# EAGLE design untitled (EAGLE 9.0.0)
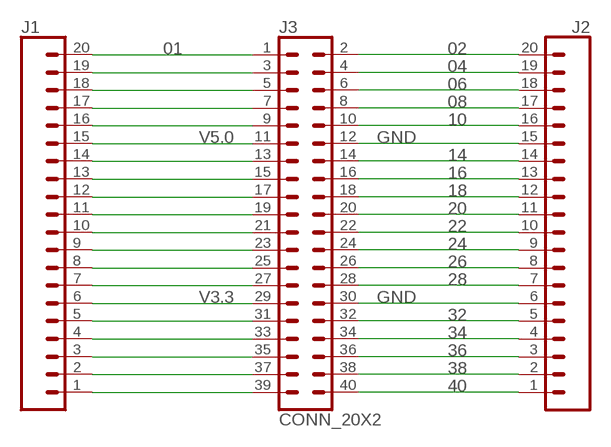
[diagram p0: schematic, sheet 1]

## Parts
J1  CONN_20  [1X20]
J2  CONN_20  [1X20]
J3  CONN_20X2  [2X20]

## Nets
01: J1.20 J3.1
02: J2.20 J3.2
04: J2.19 J3.4
5: J1.18 J3.5
06: J2.18 J3.6
08: J2.17 J3.8
10: J2.16 J3.10
14: J2.14 J3.14
15: J1.13 J3.15
16: J2.13 J3.16
18: J2.12 J3.18
20: J2.11 J3.20
22: J2.10 J3.22
24: J2.9 J3.24
25: J1.8 J3.25
26: J2.8 J3.26
28: J2.7 J3.28
32: J2.5 J3.32
34: J2.4 J3.34
35: J1.3 J3.35
36: J2.3 J3.36
38: J2.2 J3.38
39: J1.1 J3.39
40: J2.1 J3.40
GND: J2.6 J2.15 J3.12 J3.30
N$1: J1.19 J3.3
N$22: J1.2 J3.37
N$24: J1.4 J3.33
N$25: J1.5 J3.31
N$27: J1.7 J3.27
N$29: J1.9 J3.23
N$30: J1.10 J3.21
N$31: J1.11 J3.19
N$32: J1.12 J3.17
N$34: J1.14 J3.13
N$36: J1.16 J3.9
N$37: J1.17 J3.7
V3.3: J1.6 J3.29
V5.0: J1.15 J3.11

## Library data of the parts
J1 J2 = SparkFun-Connectors:CONN_20: Multi connection point. Often used as Generic Header-pin footprint for 0.1 inch spaced/style header connections On any of the 0.1 inch spaced packages, you can populate with these: Break Away Headers - Straight <https://www.sparkfun.com/products/116> (PRT-00116) Break Away Male Headers - Right Angle <https://www.sparkfun.com/products/553> (PRT-00553) Female Headers <https://www.sparkfun.com/products/115> (PRT-00115) Break Away Headers - Machine Pin <https://www.sparkfun.com/products/117> (PRT-00117) Break Away Female Headers - Swiss Machine Pin <https://www.sparkfun.com/products/743> (PRT-00743) For SCREWTERMINALS and SPRING TERMINALS visit here: Screw Terimnals on SparkFun.com <https://www.sparkfun.com/search/results?term=Screw+Terminals> (5mm/3.5mm/2.54mm spacing) This device is also useful as a general connection point to wire up your design to another part of your project. Our various solder wires solder well into these plated through hole pads. Hook-Up Wire - Assortment (Stranded, 22 AWG) <https://www.sparkfun.com/products/11375> (PRT-11375) Hook-Up Wire - Assortment (Solid Core, 22 AWG) <https://www.sparkfun.com/products/11367> (PRT-11367) View the entire wire category on our website here <https://www.sparkfun.com/categories/141> Special notes: Molex polarized connector foot print use with SKU : PRT-08231 with associated crimp pins and housings. 1MM SMD Version SKU: PRT-10208 NOTES ON THE VARIANTS LOCK and LOCK_LONGPADS... This footprint was designed to help hold the alignment of a through-hole component (i.e. 6-pin header) while soldering it into place. You may notice that each hole has been shifted either up or down by 0.005 of an inch from it's more standard position (which is a perfectly straight line). This slight alteration caused the pins (the squares in the middle) to touch the edges of the holes. Because they are alternating, it causes a "brace" to hold the component in place. 0.005 has proven to be the perfect amount of "off-center" position when using our standard breakaway headers. Although looks a little odd when you look at the bare footprint, once you have a header in there, the alteration is very hard to notice. Also,if you push a header all the way into place, it is covered up entirely on the bottom side. Note about LOCK SPECIAL package: This is just like the LOCK variant in that the holes are staggared by 5 mil, but except for the last two holes. They are not altered from the "standard" footprint layout. This is used for a special purpose on the layout of our Graphic LCD Backpack. Make sure you want to use this device before selecting it for you project!
J3 = SparkFun-Connectors:CONN_20X2: Multi connection point. Often used as Generic Header-pin footprint for 0.1 inch spaced/style header connections On any of the 0.1 inch spaced packages, you can populate with these: Break Away Headers - Straight <https://www.sparkfun.com/products/116> (PRT-00116) Break Away Male Headers - Right Angle <https://www.sparkfun.com/products/553> (PRT-00553) Female Headers <https://www.sparkfun.com/products/115> (PRT-00115) Break Away Headers - Machine Pin <https://www.sparkfun.com/products/117> (PRT-00117) Break Away Female Headers - Swiss Machine Pin <https://www.sparkfun.com/products/743> (PRT-00743)

## Board
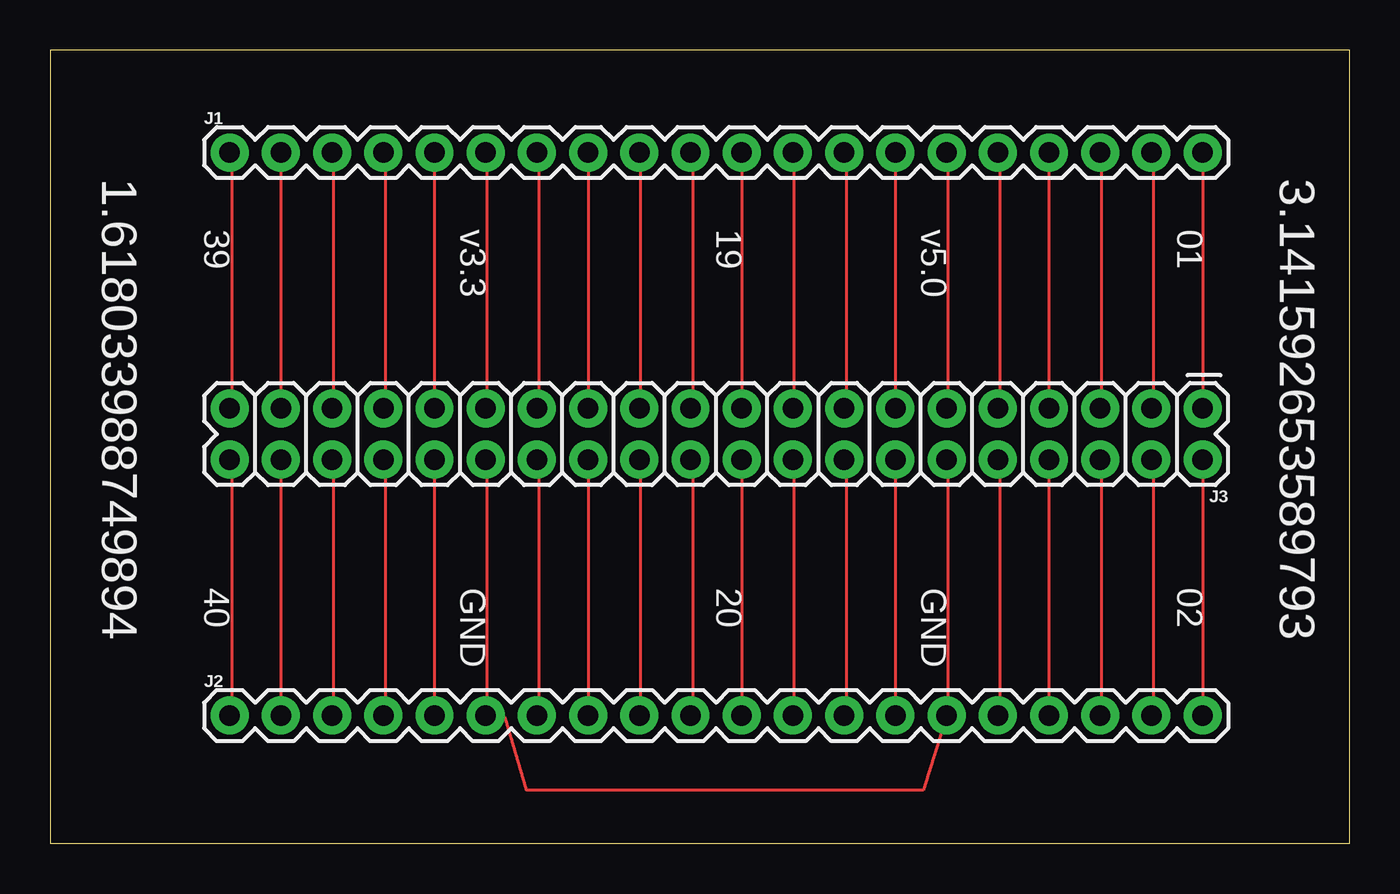
[diagram p1: board, top side]
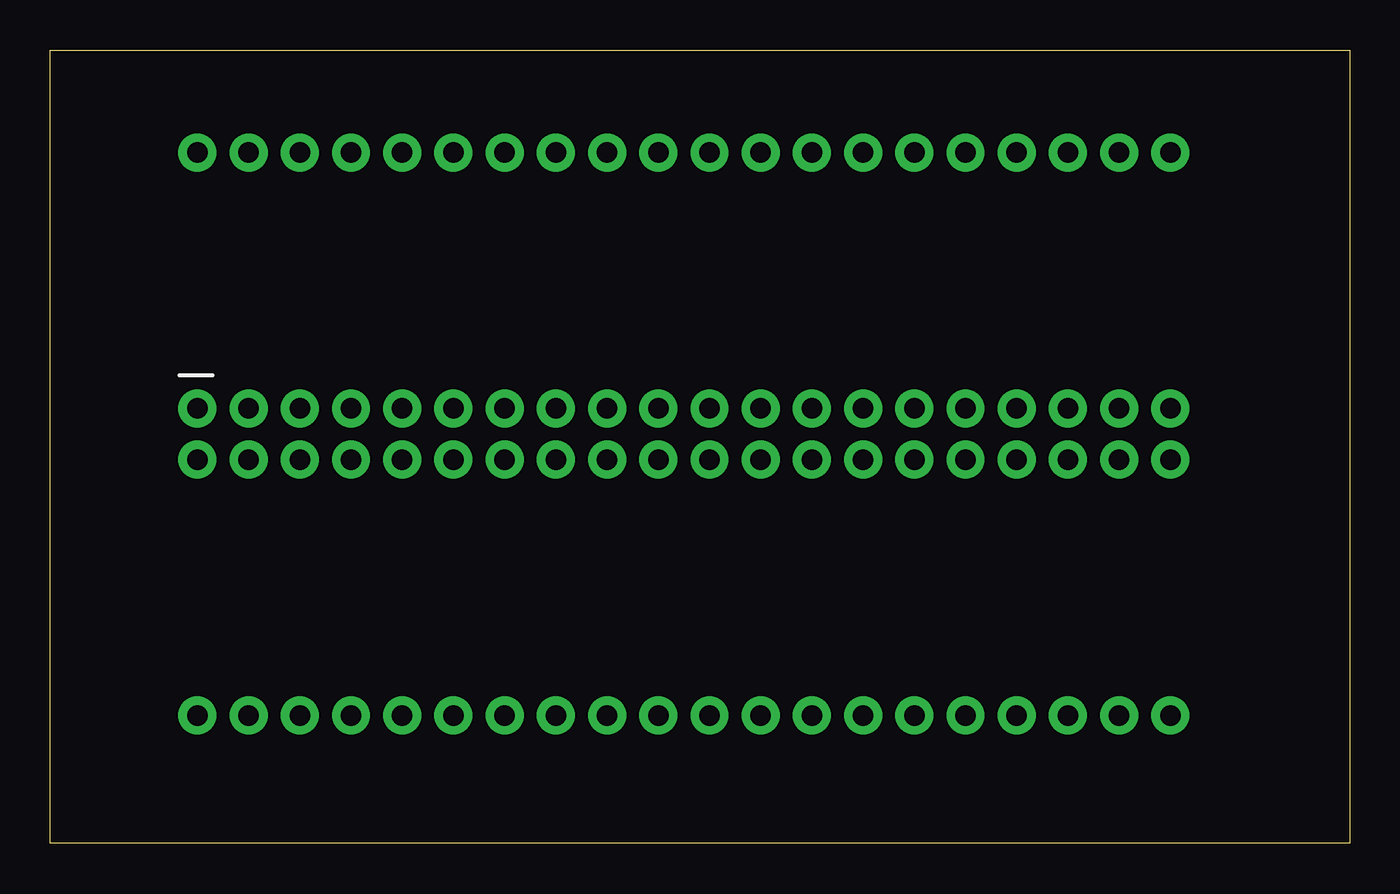
[diagram p2: board, bottom side, seen from below]

Size 64.44 x 39.36 mm. Coordinates in mm from the lower left corner, seen from the top.
Outline: 0,0 64.44,0 64.44,39.36 0,39.36 0,0
Copper layers (1*16): Top 0.035559375mm / dielectric 1.6mm / Bottom 0.035559375mm
Design rules "oshpark-2layer": minimum track width 6mil, minimum drill 10mil, track to track 6mil, track to pad 6mil, pad to pad 6mil, via to via 6mil, smd to smd 6mil, copper to edge 15mil, drill to drill 6mil, minimum pad ring 5mil, minimum via ring 5mil, stop-mask expansion 2.5mil, vias tented up to drill 0mil, thermal gap 10mil

### Footprints (pad centres in the part's own frame; a part is rotated, then mirrored left to right if it is on the bottom)
1X20 = drill 1.016 pad 1.88: 1 0,0; 2 2.54,0; 3 5.08,0; 4 7.62,0; 5 10.16,0; 6 12.7,0; 7 15.24,0; 8 17.78,0; 9 20.32,0; 10 22.86,0; 11 25.4,0; 12 27.94,0; 13 30.48,0; 14 33.02,0; 15 35.56,0; 16 38.1,0; 17 40.64,0; 18 43.18,0; 19 45.72,0; 20 48.26,0
2X20 = drill 1.016 pad 1.88: 1 0,0; 2 0,2.54; 3 2.54,0; 4 2.54,2.54; 5 5.08,0; 6 5.08,2.54; 7 7.62,0; 8 7.62,2.54; 9 10.16,0; 10 10.16,2.54; 11 12.7,0; 12 12.7,2.54; 13 15.24,0; 14 15.24,2.54; 15 17.78,0; 16 17.78,2.54; 17 20.32,0; 18 20.32,2.54; 19 22.86,0; 20 22.86,2.54; 21 25.4,0; 22 25.4,2.54; 23 27.94,0; 24 27.94,2.54; 25 30.48,0; 26 30.48,2.54; 27 33.02,0; 28 33.02,2.54; 29 35.56,0; 30 35.56,2.54; 31 38.1,0; 32 38.1,2.54; 33 40.64,0; 34 40.64,2.54; 35 43.18,0; 36 43.18,2.54; 37 45.72,0; 38 45.72,2.54; 39 48.26,0; 40 48.26,2.54

### Placement (x,y rotation side)
J1  8.89,34.29 0 top
J2  8.89,6.35 0 top
J3  57.15,21.59 180 top

### Tracks (layer width: path | path; a pad name or v marks a point on that pad's centre or on a via)
01
  Top 0.152: J1.20 J3.1
02
  Top 0.152: J3.2 J2.20
04
  Top 0.152: J2.19 54.71,6.4 54.71,19.05 J3.4
5
  Top 0.152: J3.5 52.12,21.64 52.12,34.29 J1.18
06
  Top 0.152: J2.18 52.12,6.4 52.12,19.05 J3.6
08
  Top 0.152: J3.8 J2.17
10
  Top 0.152: J2.16 47.09,6.4 47.09,19.05 J3.10
14
  Top 0.152: J3.14 J2.14
15
  Top 0.152: J3.15 39.47,21.64 39.47,34.29 J1.13
16
  Top 0.152: J2.13 39.47,6.4 39.47,19.05 J3.16
18
  Top 0.152: J2.12 36.88,6.4 36.88,19.05 J3.18
20
  Top 0.152: J3.20 J2.11
22
  Top 0.152: J2.10 31.85,6.4 31.85,19.05 J3.22
24
  Top 0.152: J2.9 29.26,6.4 29.26,19.05 J3.24
25
  Top 0.152: J1.8 J3.25
26
  Top 0.152: J3.26 J2.8
28
  Top 0.152: J2.7 24.23,6.4 24.23,19.05 J3.28
32
  Top 0.152: J3.32 J2.5
34
  Top 0.152: J2.4 16.61,6.4 16.61,19.05 J3.34
35
  Top 0.152: J3.35 14.02,21.64 14.02,34.29 J1.3
36
  Top 0.152: J2.3 14.02,6.4 14.02,19.05 J3.36
38
  Top 0.152: J3.38 J2.2
39
  Top 0.152: J3.39 8.99,21.64 8.99,34.29 J1.1
40
  Top 0.152: J2.1 8.99,6.4 8.99,19.05 J3.40
GND
  Top 0.152: J3.30 21.64,19.05 21.64,6.4 J2.6 21.64,6.25 22.55,6.25 23.62,2.64 43.28,2.64 J2.15 44.5,6.4 44.5,19.05 J3.12
N$1
  Top 0.152: J3.3 54.71,21.64 54.71,34.29 J1.19
N$22
  Top 0.152: J1.2 J3.37
N$24
  Top 0.152: J3.33 16.61,21.64 16.61,34.29 J1.4
N$25
  Top 0.152: J1.5 J3.31
N$27
  Top 0.152: J3.27 24.23,21.64 24.23,34.29 J1.7
N$29
  Top 0.152: J3.23 29.26,21.64 29.26,34.29 J1.9
N$30
  Top 0.152: J3.21 31.85,21.64 31.85,34.29 J1.10
N$31
  Top 0.152: J1.11 J3.19
N$32
  Top 0.152: J3.17 36.88,21.64 36.88,34.29 J1.12
N$34
  Top 0.152: J1.14 J3.13
N$36
  Top 0.152: J3.9 47.09,21.64 47.09,34.29 J1.16
N$37
  Top 0.152: J1.17 J3.7
V3.3
  Top 0.152: J3.29 21.64,21.64 21.64,34.29 J1.6
V5.0
  Top 0.152: J3.11 44.5,21.64 44.5,34.29 J1.15

### Text on the board
tPlace: 1.618033988749894 | 3.141592653589793 | 39 | v3.3 | 19 | v5.0 | 01 | 40 | GND | 20 | GND | 02